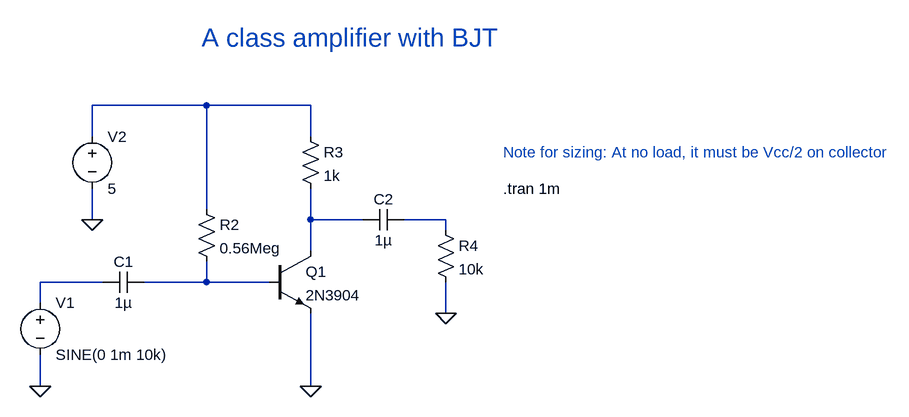
[diagram p0: schematic A-class-amplifier-bjt.asc]
A-class-amplifier-bjt.asc, the LTspice schematic file:
Version 4.1
SHEET 1 1328 680
WIRE 96 -144 -80 -144
WIRE 256 -144 96 -144
WIRE -80 -96 -80 -144
WIRE 256 -96 256 -144
WIRE 96 16 96 -144
WIRE -80 32 -80 -16
WIRE 256 32 256 -16
WIRE 336 32 256 32
WIRE 464 32 400 32
WIRE 464 48 464 32
WIRE 256 80 256 32
WIRE -64 128 -160 128
WIRE 96 128 96 96
WIRE 96 128 0 128
WIRE 192 128 96 128
WIRE -160 160 -160 128
WIRE 464 176 464 128
WIRE -160 288 -160 240
WIRE 256 288 256 176
FLAG -160 288 0
FLAG -80 32 0
FLAG 256 288 0
FLAG 464 176 0
SYMBOL res 80 0 R0
SYMATTR InstName R2
SYMATTR Value 0.56Meg
SYMBOL voltage -160 144 R0
WINDOW 123 0 0 Left 2
WINDOW 39 0 0 Left 2
SYMATTR InstName V1
SYMATTR Value SINE(0 1m 10k)
SYMBOL voltage -80 -112 R0
WINDOW 123 0 0 Left 2
WINDOW 39 0 0 Left 2
SYMATTR InstName V2
SYMATTR Value 5
SYMBOL npn 192 80 R0
SYMATTR InstName Q1
SYMATTR Value 2N3904
SYMBOL cap 0 112 R90
WINDOW 0 0 32 VBottom 2
WINDOW 3 32 32 VTop 2
SYMATTR InstName C1
SYMATTR Value 1µ
SYMBOL res 240 -112 R0
SYMATTR InstName R3
SYMATTR Value 1k
SYMBOL cap 400 16 R90
WINDOW 0 0 32 VBottom 2
WINDOW 3 32 32 VTop 2
SYMATTR InstName C2
SYMATTR Value 1µ
SYMBOL res 448 32 R0
SYMATTR InstName R4
SYMATTR Value 10k
TEXT 552 -16 Left 2 !.tran 1m
TEXT 552 -72 Left 2 ;Note for sizing: At no load, it must be Vcc/2 on collector
TEXT 88 -248 Left 4 ;A class amplifier with BJT

The netlist it stands for:
* A-class-amplifier-bjt.asc
R2 N001 N005 0.56Meg
V1 N004 0 SINE(0 1m 10k)
V2 N001 0 5
Q1 N002 N005 0 0 2N3904
C1 N005 N004 1µ
R3 N001 N002 1k
C2 N003 N002 1µ
R4 N003 0 10k
.model NPN NPN
.model PNP PNP
.lib standard.bjt
.tran 1m
* Note for sizing: At no load, it must be Vcc/2 on collector
* A class amplifier with BJT
.backanno
.end